# Altium schematic sheet 下程序炸炉.SchDoc
size A1
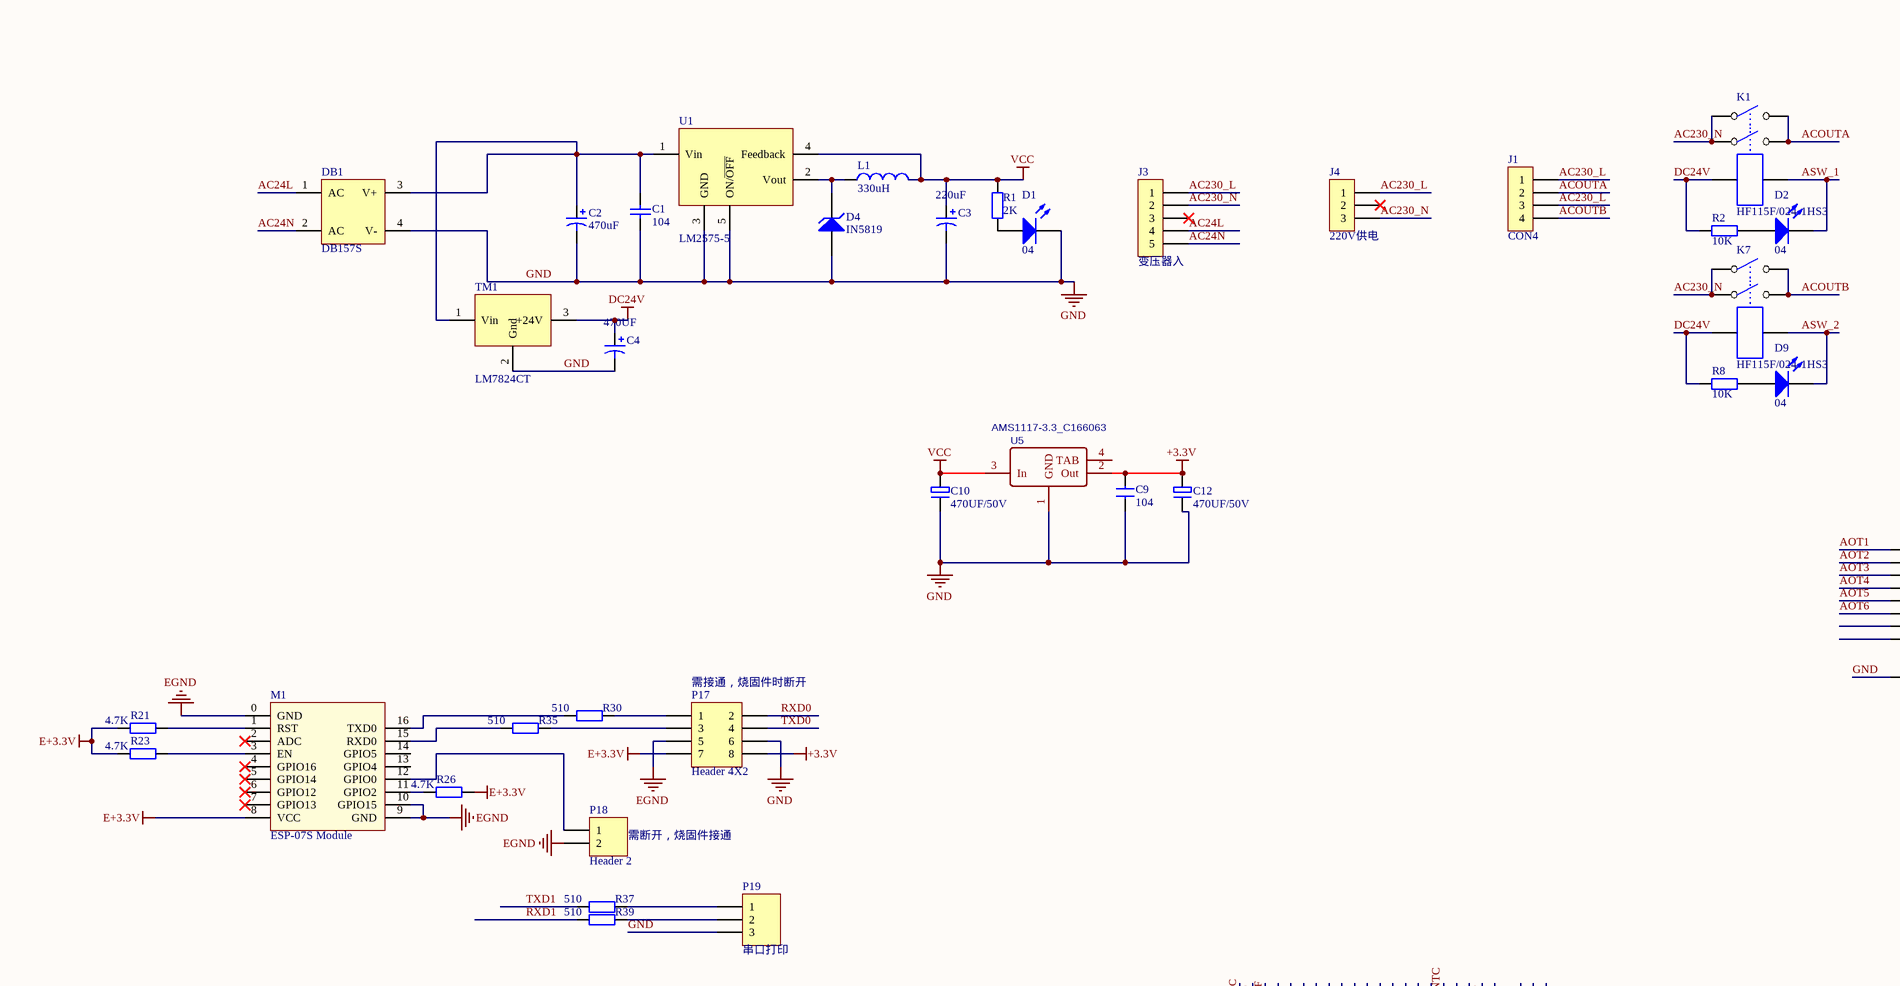
[diagram p0: 下程序炸炉.SchDoc, top left]
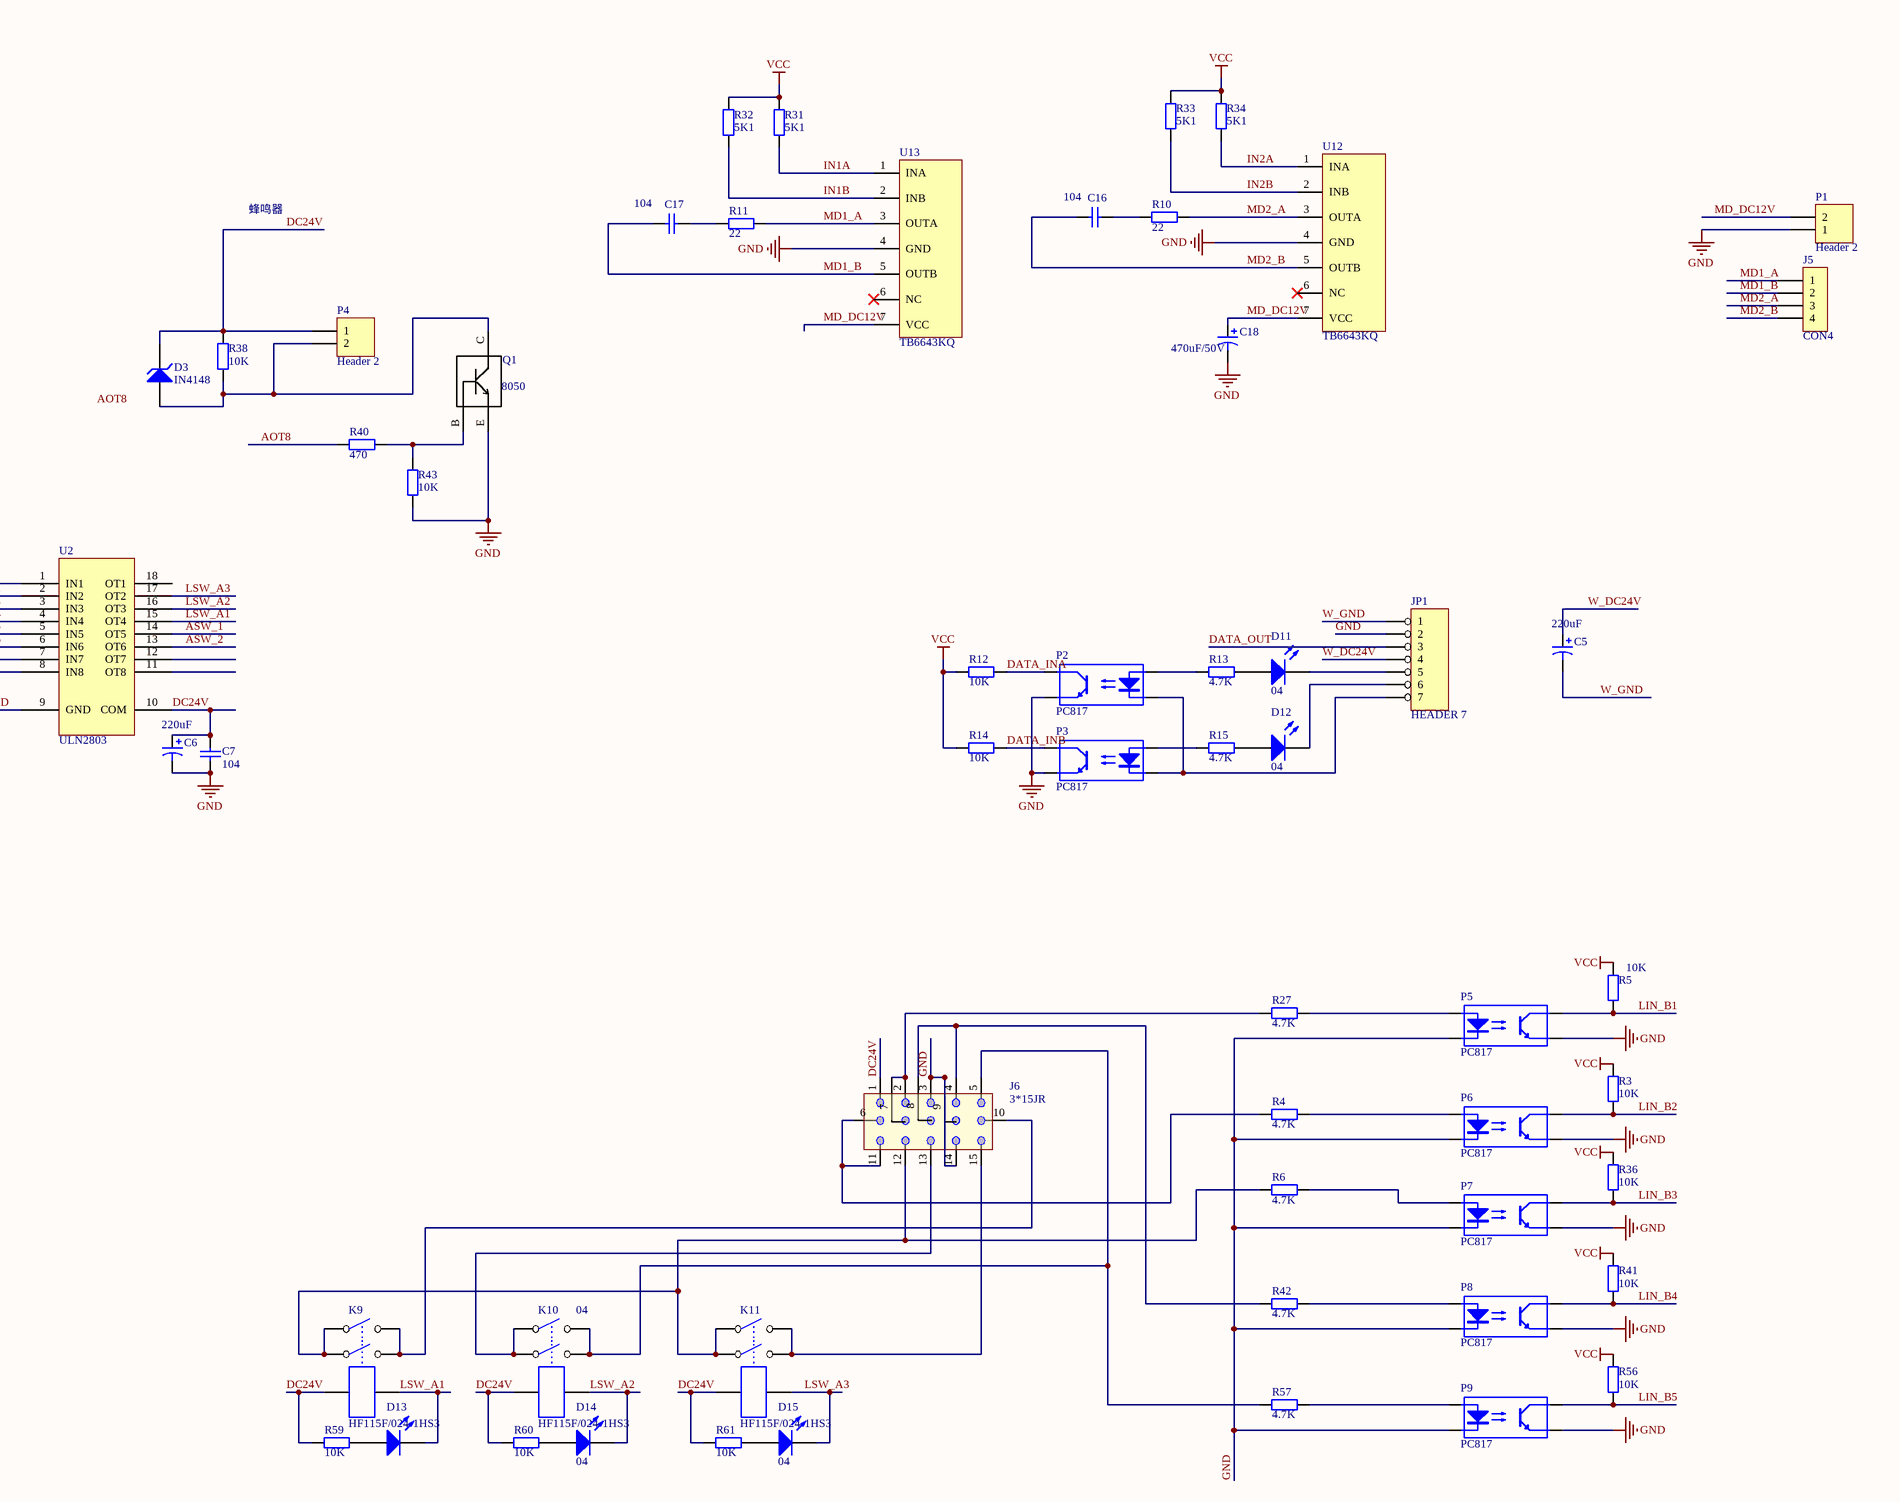
[diagram p1: 下程序炸炉.SchDoc, top right]
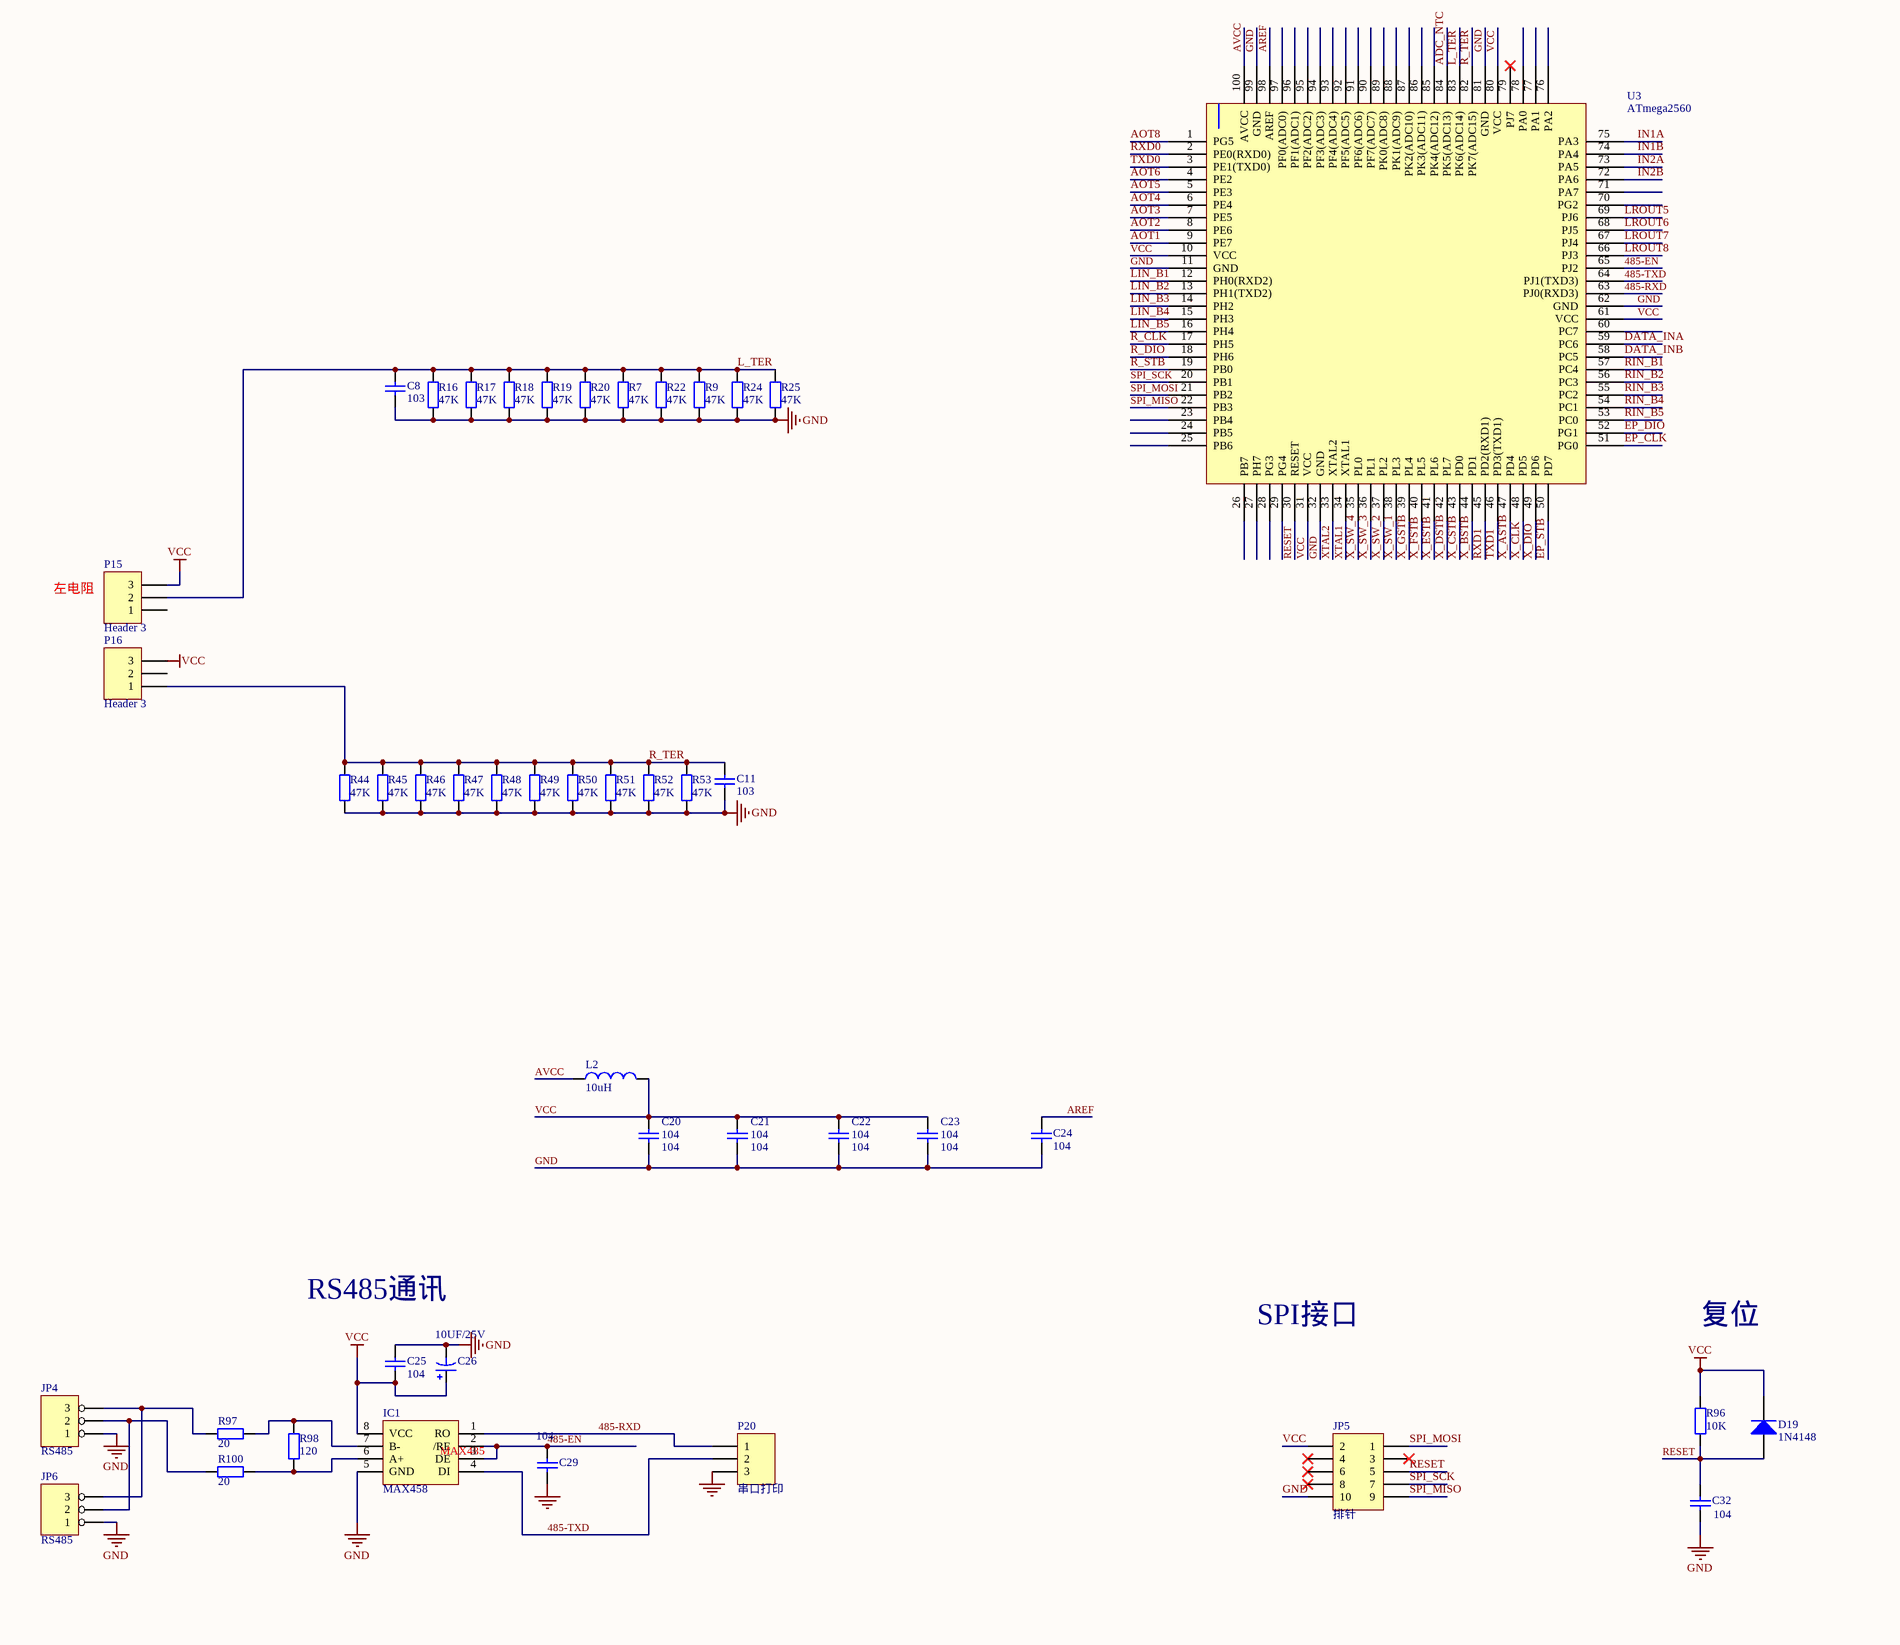
[diagram p2: 下程序炸炉.SchDoc, bottom left]
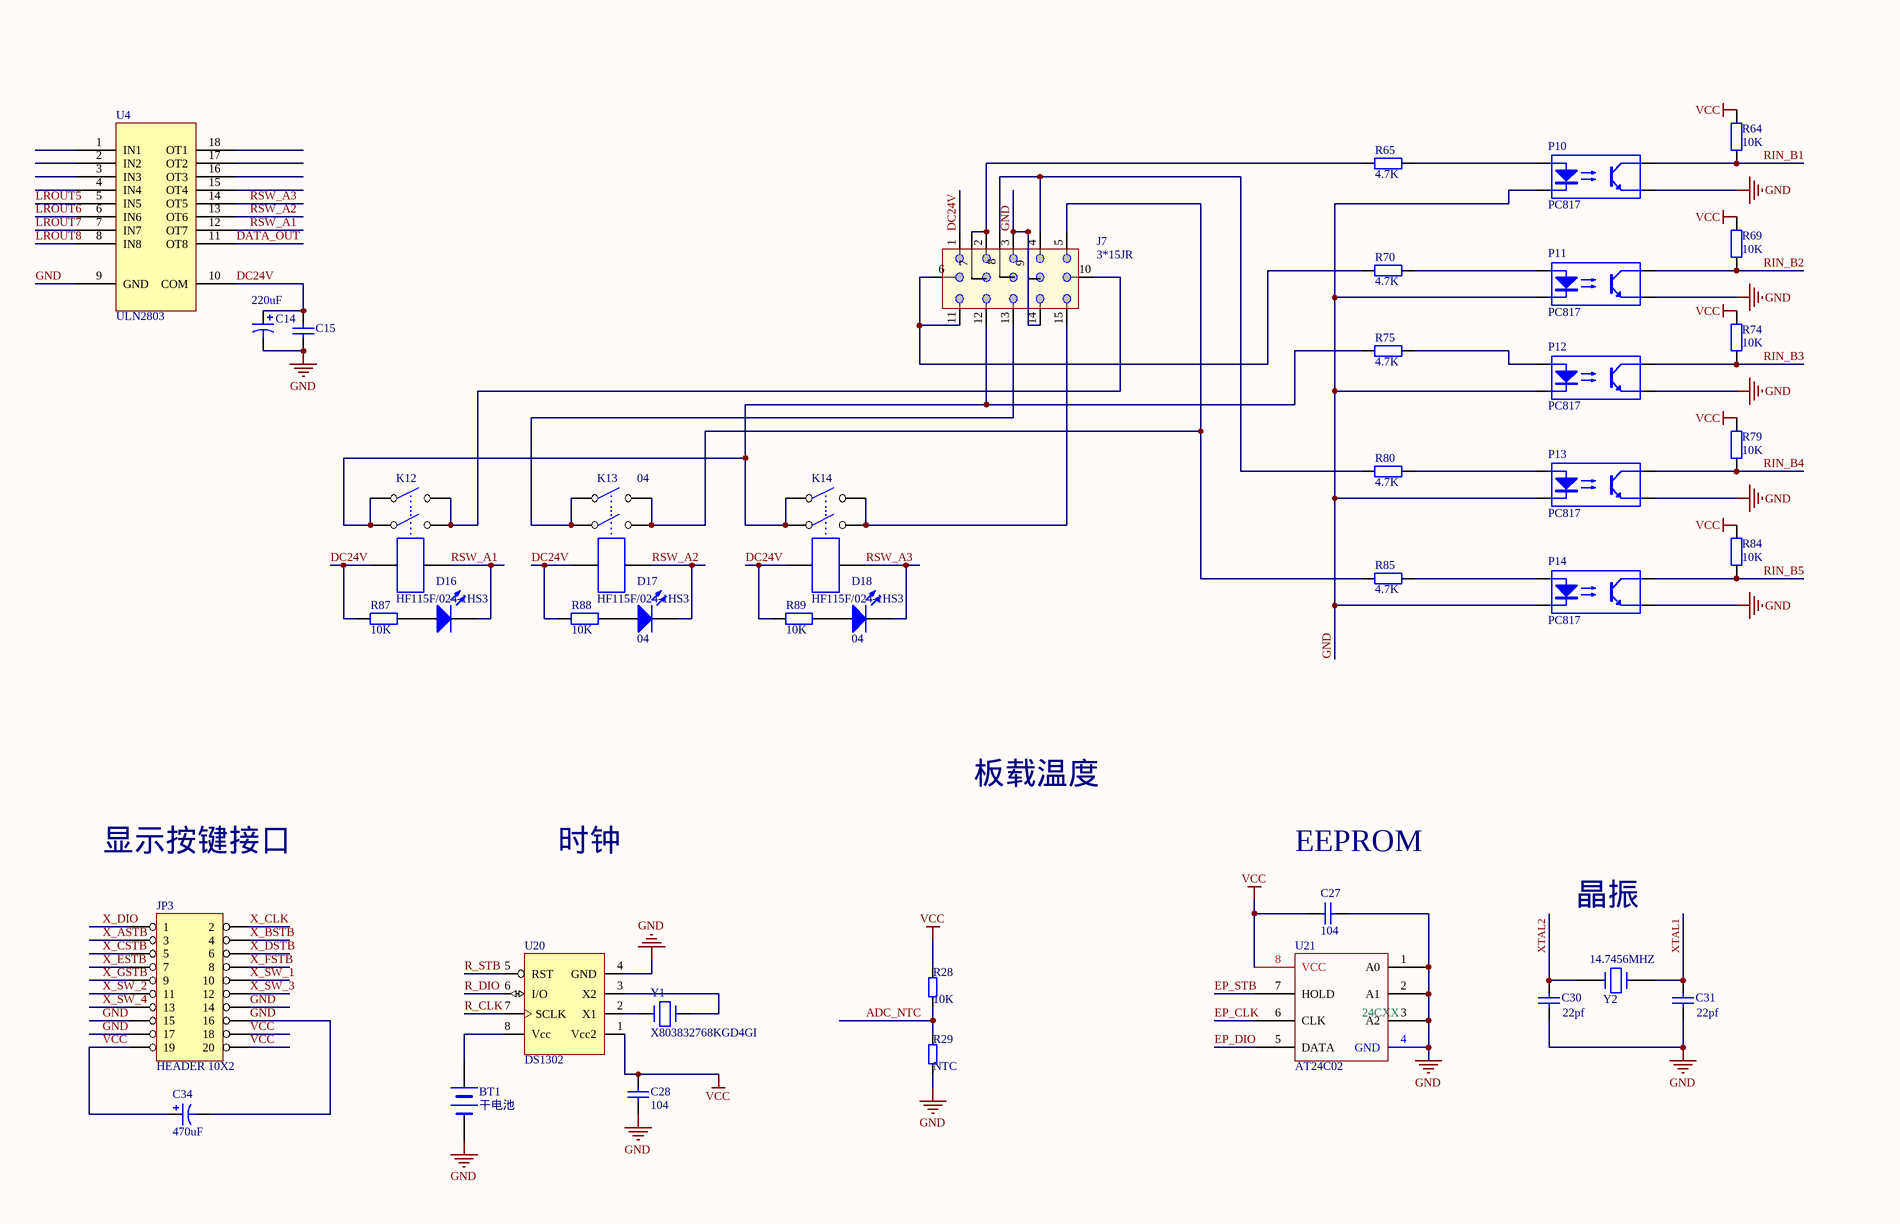
[diagram p3: 下程序炸炉.SchDoc, bottom right]

## Parts
BT1  干电池  [BAT-TH_BS-2-1]
C1  104  [0805]
C2  value 470uF  [CD9]  (hidden comment: 470UF/50V)
C3  220uF  [CD9]
C4  470UF  [CD9]
C5  220uF  [CD9]
C6  220uF  [CD9]
C7  104  [0805]
C8  103  [0805]
C9  104  [0805]
C10  470UF/50V  [CD9]
C11  103  [0805]
C12  470UF/50V  [CD9]
C14  220uF  [CD9]
C15  104  [0805]  (value not drawn)
C16  104  [0805]
C17  104  [0805]
C18  470uF/50V  [CD9]
C20  104  [0805]
C21  104  [0805]
C22  104  [0805]
C23  104  [0805]
C24  104  [0805]
C25  104  [0805]
C26  10UF/25V  [cap]
C27  104  [0805]
C28  104  [0805]
C29  104  [0805]
C30  22pf  [0805]
C31  22pf  [0805]
C32  104  [0805]
C34  value 470uF  [CD9]  (hidden comment: 470UF/50V)
D1  04  [LED-T]
D2  04  [LED-T]
D3  IN4148  [DO-214AC]
D4  IN5819  [DO-214AC]
D9  04  [LED-T]
D11  04  [LED-T]
D12  04  [LED-T]
D13  04  [LED-T]
D14  04  [LED-T]
D15  04  [LED-T]
D16  04  [LED-T]
D17  04  [LED-T]
D18  04  [LED-T]
D19  1N4148  [DO-214AC]
DB1  DB157S  [LC-GBU]
IC1  MAX458  [SOIC-8_150mil]
J1  CON4  [4PIN-6.3]
J3  变压器入  [5PIN-6.3]
J4  220V供电  [3PIN-6.3]
J5  CON4  [4PIN 3.96]
J6  3*15JR  [3*5PIN-6.3]
J7  3*15JR  [3*5PIN-6.3]
JP1  HEADER 7  [7PIN 3.96]
JP3  HEADER 10X2  [HDR2X10]
JP4  RS485  [3PIN 3.96]
JP5  排针  [HDR2X5 - duplicate - duplicate]
JP6  RS485  [3PIN 3.96]
K1  HF115F/024-1HS3  [HF115FA]
K7  HF115F/024-1HS3  [HF115FA]
K9  HF115F/024-1HS3  [HF115FA]
K10  HF115F/024-1HS3  [HF115FA]
K11  HF115F/024-1HS3  [HF115FA]
K12  HF115F/024-1HS3  [HF115FA]
K13  HF115F/024-1HS3  [HF115FA]
K14  HF115F/024-1HS3  [HF115FA]
L1  330uH  [SMD331]
L2  10uH  [1206]
M1  ESP-07S Module  [ESP-07S Module]
P1  Header 2  [2PIN 3.96]
P2  PC817  [LC-SMD-4]
P3  PC817  [LC-SMD-4]
P4  Header 2  [2PIN 3.96]
P5  PC817  [LC-SMD-4]
P6  PC817  [LC-SMD-4]
P7  PC817  [LC-SMD-4]
P8  PC817  [LC-SMD-4]
P9  PC817  [LC-SMD-4]
P10  PC817  [LC-SMD-4]
P11  PC817  [LC-SMD-4]
P12  PC817  [LC-SMD-4]
P13  PC817  [LC-SMD-4]
P14  PC817  [LC-SMD-4]
P15  Header 3  [3PIN 3.96]
P16  Header 3  [3PIN 3.96]
P17  Header 4X2  [HDR2X4]
P18  Header 2  [HDR1X2]
P19  串口打印  [HDR1X3]
P20  串口打印  [HDR1X3]
Q1  8050  [SOT-23 - duplicate]
R1  2K  [0805]
R2  10k  [0805]
R3  10k  [0805]
R4  4.7K  [0805]
R5  10k  [0805]
R6  4.7K  [0805]
R7  47K  [0805]
R8  10k  [0805]
R9  47K  [0805]
R10  22  [1206]
R11  22  [1206]
R12  10k  [0805]
R13  4.7K  [0805]
R14  10k  [0805]
R15  4.7K  [0805]
R16  47K  [0805]
R17  47K  [0805]
R18  47K  [0805]
R19  47K  [0805]
R20  47K  [0805]
R21  4.7K  [0805]
R22  47K  [0805]
R23  4.7K  [0805]
R24  47K  [0805]
R25  47K  [0805]
R26  4.7K  [0805]
R27  4.7K  [0805]
R28  10K  [0805]
R29  NTC  [0805]
R30  510  [0805]
R31  5K1  [0805]
R32  5K1  [0805]
R33  5K1  [0805]
R34  5K1  [0805]
R35  510  [0805]
R36  10k  [0805]
R37  510  [0805]
R38  10K  [0805]
R39  510  [0805]
R40  470  [0805]
R41  10k  [0805]
R42  4.7K  [0805]
R43  10K  [0805]
R44  47K  [0805]
R45  47K  [0805]
R46  47K  [0805]
R47  47K  [0805]
R48  47K  [0805]
R49  47K  [0805]
R50  47K  [0805]
R51  47K  [0805]
R52  47K  [0805]
R53  47K  [0805]
R56  10k  [0805]
R57  4.7K  [0805]
R59  10k  [0805]
R60  10k  [0805]
R61  10k  [0805]
R64  10k  [0805]
R65  4.7K  [0805]
R69  10k  [0805]
R70  4.7K  [0805]
R74  10k  [0805]
R75  4.7K  [0805]
R79  10k  [0805]
R80  4.7K  [0805]
R84  10k  [0805]
R85  4.7K  [0805]
R87  10k  [0805]
R88  10k  [0805]
R89  10k  [0805]
R96  10k  [0805]
R97  20  [0805]
R98  120  [0805]
R100  20  [0805]
TM1  LM7824CT  [TO-220]
U1  LM2575-5  [D2PAK]
U2  ULN2803  [SOP-18_300mil]
U3  ATmega2560  [TQFP100]
U4  ULN2803  [SOP-18_300mil]
U5  AMS1117-3.3_C166063  [SOT-223_L6.7-W3.5-P2.30-BR]
U12  TB6643KQ  [TA8428 - S]
U13  TB6643KQ  [TA8428 - S]
U20  DS1302  [SOIC-8_150mil]
U21  AT24C02  [SOIC-8_150mil]
Y1  X803832768KGD4GI  [YSX306]
Y2  14.7456MHZ  [HC-49SMD]

## Nets
+3.3V: C9.1 C12.1 P17.8 U5.2(Out)
DC24V: C4.1 C6.1 C7.2 C14.1 C15.2 D3.2(K) J6.1 J7.1 K1.5 K7.5 K9.5 K10.5 K11.5 K12.5 K13.5 K14.5 P4.1 R2.2 R8.2 R38.2 R59.2 R60.2 R61.2 R87.2 R88.2 R89.2 TM1.3(+24V) U2.10(COM) U4.10(COM)
E+3.3V: M1.8(VCC) P17.7 R21.2 R23.2 R26.1
EGND: M1.0(GND) M1.9(GND) M1.10(GPIO15) P17.5 P18.2
GND: BT1.2(-) C1.1 C2.2 C3.2 C4.2 C6.2 C7.1 C8.1 C9.2 C10.2 C11.1 C12.2 C14.2 C15.1 C18.2 C20.1 C21.1 C22.1 C23.1 C24.1 C25.2 C26.2 C27.1 C28.1 C29.1 C30.1 C31.1 C32.1 C34.2 D1.2(K) D4.1(A) DB1.4(V-) IC1.5(GND) J6.3 J6.9 J6.14 J7.3 J7.9 J7.14 JP1.2 JP3.14 JP3.15 JP3.16 JP3.17 JP4.1 JP5.10 JP6.1 P1.1 P2.3(Emitter) P3.3(Emitter) P5.2(LED_Cathode) P5.3(Emitter) P6.2(LED_Cathode) P6.3(Emitter) P7.2(LED_Cathode) P7.3(Emitter) P8.2(LED_Cathode) P8.3(Emitter) P9.2(LED_Cathode) P9.3(Emitter) P10.2(LED_Cathode) P10.3(Emitter) P11.2(LED_Cathode) P11.3(Emitter) P12.2(LED_Cathode) P12.3(Emitter) P13.2(LED_Cathode) P13.3(Emitter) P14.2(LED_Cathode) P14.3(Emitter) P17.6 P19.3 P20.3 Q1.E R7.1 R9.1 R16.1 R17.1 R18.1 R19.1 R20.1 R22.1 R24.1 R25.1 R29.1 R43.1 R44.1 R45.1 R46.1 R47.1 R48.1 R49.1 R50.1 R51.1 R52.1 R53.1 TM1.2(Gnd) U1.3(GND) U1.5(ON/~{OFF}) U2.9(GND) U3.11(GND) U3.32(GND) U3.62(GND) U3.81(GND) U3.99(GND) U4.9(GND) U5.1(GND) U12.4(GND) U13.4(GND) U20.4(GND) U21.1(A0) U21.2(A1) U21.3(A2) U21.4(GND)
VCC: C3.1 C10.1 C20.2 C21.2 C22.2 C23.2 C25.1 C26.1 C27.2 C28.2 C34.1 D19.2(K) IC1.8(VCC) JP3.18 JP3.19 JP3.20 JP5.2 L1.2 L2.2 P15.3 P16.3 R1.2 R3.2 R5.2 R12.1 R14.1 R28.2 R31.2 R32.2 R33.2 R34.2 R36.2 R41.2 R56.2 R64.2 R69.2 R74.2 R79.2 R84.2 R96.2 U1.4(Feedback) U3.10(VCC) U3.31(VCC) U3.61(VCC) U3.80(VCC) U5.3(In) U20.1(Vcc2) U21.8(VCC)
485-EN: C29.2 IC1.2(/RE) IC1.3(DE) U3.65(PJ2)
485-RXD: IC1.1(RO) P20.1 U3.63(PJ0(RXD3))
485-TXD: IC1.4(DI) P20.2 U3.64(PJ1(TXD3))
AC24L: DB1.1(AC) J3.4
AC24N: DB1.2(AC) J3.5
AC230_L: J1.1 J1.3 J3.1 J4.1
AC230_N: J3.2 J4.3 K1.1 K1.3 K7.1 K7.3
ACOUTA: J1.2 K1.2 K1.4
ACOUTB: J1.4 K7.2 K7.4
ADC_NTC: R28.1 R29.2 U3.84(PK5(ADC13))
AOT1: U2.1(IN1) U3.9(PE7)
AOT2: U2.2(IN2) U3.8(PE6)
AOT3: U2.3(IN3) U3.7(PE5)
AOT4: U2.4(IN4) U3.6(PE4)
AOT5: U2.5(IN5) U3.5(PE3)
AOT6: U2.6(IN6) U3.4(PE2)
AOT8: R40.1 U3.1(PG5)
AREF: C24.2 U3.98(AREF)
ASW_1: D2.2(K) K1.6 U2.14(OT5)
ASW_2: D9.2(K) K7.6 U2.13(OT6)
AVCC: L2.1 U3.100(AVCC)
DATA_INA: P2.4(Collector) R12.2 U3.59(PC6)
DATA_INB: P3.4(Collector) R14.2 U3.58(PC5)
DATA_OUT: JP1.3 U4.11(OT8)
EP_CLK: U3.51(PG0) U21.6(CLK)
EP_DIO: U3.52(PG1) U21.5(DATA)
EP_STB: U3.50(PD7) U21.7(HOLD)
IN1A: R31.1 U3.75(PA3) U13.1(INA)
IN1B: R32.1 U3.74(PA4) U13.2(INB)
IN2A: R34.1 U3.73(PA5) U12.1(INA)
IN2B: R33.1 U3.72(PA6) U12.2(INB)
L_TER: C8.2 P15.2 R7.2 R9.2 R16.2 R17.2 R18.2 R19.2 R20.2 R22.2 R24.2 R25.2 U3.83(PK6(ADC14))
LIN_B1: P5.4(Collector) R5.1 U3.12(PH0(RXD2))
LIN_B2: P6.4(Collector) R3.1 U3.13(PH1(TXD2))
LIN_B3: P7.4(Collector) R36.1 U3.14(PH2)
LIN_B4: P8.4(Collector) R41.1 U3.15(PH3)
LIN_B5: P9.4(Collector) R56.1 U3.16(PH4)
LROUT5: U3.69(PJ6) U4.5(IN5)
LROUT6: U3.68(PJ5) U4.6(IN6)
LROUT7: U3.67(PJ4) U4.7(IN7)
LROUT8: U3.66(PJ3) U4.8(IN8)
LSW_A1: D13.2(K) K9.6 U2.15(OT4)
LSW_A2: D14.2(K) K10.6 U2.16(OT3)
LSW_A3: D15.2(K) K11.6 U2.17(OT2)
MD1_A: J5.1 R11.1 U13.3(OUTA)
MD1_B: C17.2 J5.2 U13.5(OUTB)
MD2_A: J5.3 R10.1 U12.3(OUTA)
MD2_B: C16.2 J5.4 U12.5(OUTB)
MD_DC12V: C18.1 P1.2 U12.7(VCC) U13.7(VCC)
R_CLK: U3.17(PH5) U20.7(SCLK)
R_DIO: U3.18(PH6) U20.6(I/O)
R_STB: U3.19(PB0) U20.5(RST)
R_TER: C11.2 P16.1 R44.2 R45.2 R46.2 R47.2 R48.2 R49.2 R50.2 R51.2 R52.2 R53.2 U3.82(PK7(ADC15))
RESET: C32.2 D19.1(A) JP5.5 R96.1 U3.30(RESET)
RIN_B1: P10.4(Collector) R64.1 U3.57(PC4)
RIN_B2: P11.4(Collector) R69.1 U3.56(PC3)
RIN_B3: P12.4(Collector) R74.1 U3.55(PC2)
RIN_B4: P13.4(Collector) R79.1 U3.54(PC1)
RIN_B5: P14.4(Collector) R84.1 U3.53(PC0)
RSW_A1: D16.2(K) K12.6 U4.12(OT7)
RSW_A2: D17.2(K) K13.6 U4.13(OT6)
RSW_A3: D18.2(K) K14.6 U4.14(OT5)
RXD0: P17.2 U3.2(PE0(RXD0))
RXD1: R39.2 U3.45(PD2(RXD1))
SPI_MISO: JP5.9 U3.22(PB3)
SPI_MOSI: JP5.1 U3.21(PB2)
SPI_SCK: JP5.7 U3.20(PB1)
TXD0: P17.4 U3.3(PE1(TXD0))
TXD1: R37.2 U3.46(PD3(TXD1))
W_DC24V: C5.1 JP1.4
W_GND: C5.2 JP1.1
X_ASTB: JP3.3 U3.47(PD4)
X_BSTB: JP3.4 U3.44(PD1)
X_CLK: JP3.2 U3.48(PD5)
X_CSTB: JP3.5 U3.43(PD0)
X_DIO: JP3.1 U3.49(PD6)
X_DSTB: JP3.6 U3.42(PL7)
X_ESTB: JP3.7 U3.41(PL6)
X_FSTB: JP3.8 U3.40(PL5)
X_GSTB: JP3.9 U3.39(PL4)
X_SW_1: JP3.10 U3.38(PL3)
X_SW_2: JP3.11 U3.37(PL2)
X_SW_3: JP3.12 U3.36(PL1)
X_SW_4: JP3.13 U3.35(PL0)
XTAL1: C31.2 U3.34(XTAL1) Y2.2
XTAL2: C30.2 U3.33(XTAL2) Y2.1
NetBT1_1: BT1.1(+) U20.8(Vcc)
NetC1_2: C1.2 C2.1 DB1.3(V+) TM1.1(Vin) U1.1(Vin)
NetC16_1: C16.1 R10.2
NetC17_1: C17.1 R11.2
NetD1_1: D1.1(A) R1.1
NetD2_1: D2.1(A) R2.1
NetD3_1: D3.1(A) P4.2 Q1.C R38.1
NetD4_2: D4.2(K) L1.1 U1.2(Vout)
NetD9_1: D9.1(A) R8.1
NetD11_1: D11.1(A) R13.1
NetD11_2: D11.2(K) JP1.5
NetD12_1: D12.1(A) R15.1
NetD12_2: D12.2(K) JP1.6
NetD13_1: D13.1(A) R59.1
NetD14_1: D14.1(A) R60.1
NetD15_1: D15.1(A) R61.1
NetD16_1: D16.1(A) R87.1
NetD17_1: D17.1(A) R88.1
NetD18_1: D18.1(A) R89.1
NetIC1_6: IC1.6(A+) R98.2 R100.1
NetIC1_7: IC1.7(B-) R97.1 R98.1
NetJ6_2: J6.2 J6.7 R27.1
NetJ6_4: J6.4 J6.8 R42.1
NetJ6_5: J6.5 K10.2 K10.4 R57.1
NetJ6_6: J6.6 J6.11 R4.1
NetJ6_10: J6.10 K9.2 K9.4
NetJ6_12: J6.12 K9.1 K9.3 K11.1 K11.3 R6.1
NetJ6_13: J6.13 K10.1 K10.3
NetJ6_15: J6.15 K11.2 K11.4
NetJ7_2: J7.2 J7.7 R65.1
NetJ7_4: J7.4 J7.8 R80.1
NetJ7_5: J7.5 K13.2 K13.4 R85.1
NetJ7_6: J7.6 J7.11 R70.1
NetJ7_10: J7.10 K12.2 K12.4
NetJ7_12: J7.12 K12.1 K12.3 K14.1 K14.3 R75.1
NetJ7_13: J7.13 K13.1 K13.3
NetJ7_15: J7.15 K14.2 K14.4
NetJP1_7: JP1.7 P2.2(LED_Cathode) P3.2(LED_Cathode)
NetJP4_2: JP4.2 JP6.2 R100.2
NetJP4_3: JP4.3 JP6.3 R97.2
NetM1_1: M1.1(RST) R21.1
NetM1_3: M1.3(EN) R23.1
NetM1_11: M1.11(GPIO2) R26.2
NetM1_12: M1.12(GPIO0) P18.1
NetM1_15: M1.15(RXD0) R35.2
NetM1_16: M1.16(TXD0) R30.2
NetP2_1: P2.1(LED_Anode) R13.2
NetP3_1: P3.1(LED_Anode) R15.2
NetP5_1: P5.1(LED_Anode) R27.2
NetP6_1: P6.1(LED_Anode) R4.2
NetP7_1: P7.1(LED_Anode) R6.2
NetP8_1: P8.1(LED_Anode) R42.2
NetP9_1: P9.1(LED_Anode) R57.2
NetP10_1: P10.1(LED_Anode) R65.2
NetP11_1: P11.1(LED_Anode) R70.2
NetP12_1: P12.1(LED_Anode) R75.2
NetP13_1: P13.1(LED_Anode) R80.2
NetP14_1: P14.1(LED_Anode) R85.2
NetP17_1: P17.1 R30.1
NetP17_3: P17.3 R35.1
NetP19_1: P19.1 R37.1
NetP19_2: P19.2 R39.1
NetQ1_B: Q1.B R40.2 R43.2
NetU20_2: U20.2(X1) Y1.1
NetU20_3: U20.3(X2) Y1.2

Not connected (* = marked no-connect by the designer): J3 3*; J4 2*; JP5 3* 4* 6* 8*; M1 2(ADC)* 4(GPIO16)* 5(GPIO14)* 6(GPIO12)* 7(GPIO13)* 13(GPIO4) 14(GPIO5); P15 1; P16 2; U2 7(IN7) 8(IN8) 11(OT8) 12(OT7) 18(OT1); U3 23(PB4) 24(PB5) 25(PB6) 26(PB7) 27(PH7) 28(PG3) 29(PG4) 60(PC7) 70(PG2) 71(PA7) 76(PA2) 77(PA1) 78(PA0) 79(PJ7)* 85(PK4(ADC12)) 86(PK3(ADC11)) 87(PK2(ADC10)) 88(PK1(ADC9)) 89(PK0(ADC8)) 90(PF7(ADC7)) 91(PF6(ADC6)) 92(PF5(ADC5)) 93(PF4(ADC4)) 94(PF3(ADC3)) 95(PF2(ADC2)) 96(PF1(ADC1)) 97(PF0(ADC0)); U4 1(IN1) 2(IN2) 3(IN3) 4(IN4) 15(OT4) 16(OT3) 17(OT2) 18(OT1); U5 4(TAB); U12 6(NC)*; U13 6(NC)*

## Notes on the sheet
- 蜂鸣器
- (near P17) 需接通，烧固件时断开
- (near P18) 需断开，烧固件接通
- 左电阻
- 板载温度
- RS485通讯
- SPI接口
- 复位
- 显示按键接口
- 时钟
- EEPROM
- 晶振
- Labels drawn without touching a wire or pin: AOT8
- Title
- Size:
- Date:
- File:
- A1
- Number:
- Time:
- Revision:
- Sheet
- of

## Library data of the parts
BT1 = 干电池: Battery
C1 C7 C8 C11 C15-C17 C20-C25 C27-C32 = Cap: Capacitor; Published: 8-Jun-2000; LatestRevisionDate: 17-Jul-2002; LatestRevisionNote: Re-released for DXP Platform.; PackageReference: RAD-0.3; Publisher: Altium Limited
  C1 C7 C15 C20-C25 C27-C29: Value: 104
  C8 C11: Value: 103
C2 C4 C18 C34 = Cap Pol1: Polarized Capacitor (Radial); Published: 8-Jun-2000; LatestRevisionDate: 17-Jul-2002; LatestRevisionNote: Re-released for DXP Platform.; PackageReference: RB7.6-15; Publisher: Altium Limited
  C4: Value: 470uF
C3 C5 C6 C14 = Cap Pol1: Polarized Capacitor (Radial); Value: 470uF; Published: 8-Jun-2000; LatestRevisionDate: 17-Jul-2002; LatestRevisionNote: Re-released for DXP Platform.; PackageReference: RB7.6-15; Publisher: Altium Limited
C9 = CAP
C10 C12 = ECAP
C26 = Cap Pol1: Polarized Capacitor (Radial); Value: 10uF/10V; Published: 8-Jun-2000; LatestRevisionDate: 17-Jul-2002; LatestRevisionNote: Re-released for DXP Platform.; PackageReference: RB7.6-15; Publisher: Altium Limited
D1 D2 D9 D11-D18 = LED0: Typical INFRARED GaAs LED; Published: 8-Jun-2000; LatestRevisionDate: 08-Jul-2005; LatestRevisionNote: Mech Layer 1 removed.; PackageReference: LED-0; Publisher: Altium Limited; PackageDescription: LED; 2 Leads
D3 D4 = D Zener: Zener Diode; Published: 8-Jun-2000; LatestRevisionDate: 17-Jul-2002; LatestRevisionNote: Re-released for DXP Platform.; PackageReference: DIODE-0.7; Publisher: Altium Limited
D19 = Diode 1N4148: High Conductance Fast Diode; Published: 8-Jun-2000; LatestRevisionDate: 17-Jul-2002; LatestRevisionNote: Re-released for DXP Platform.; DatasheetVersion: 1997; PackageReference: DO-35; Publisher: Altium Limited; PackageDescription: Diode, Axial; Body 3.8 x 1.9 mm (LxDia. max), Lead Dia. 0.53 mm (max); Code_JEDEC: DO-204-AH; ComponentLink1Description: Manufacturer Link; ComponentLink1URL: http://www.fairchildsemi.com/; ComponentLink2Description: Datasheet; ComponentLink2URL: http://www.fairchildsemi.com/ds/1N%2F1N4148.pdf
DB1 = BRIDGE2
IC1 = MAX485
J1 J5 = CON4: Connector
J3 = CON5: Connector
J4 = CON3: Connector
J6 J7 U12 U13 = Component_1
JP4 JP6 = HEADER 3
JP5 = Header 5X2: Header, 5-Pin, Dual row; LatestRevisionDate: 17-Jul-2002; LatestRevisionNote: Re-released for DXP Platform.; Publisher: Altium Limited
K1 K7 K9-K14 = RELAY-DPST
L1 L2 = Inductor: Code_IEC: 1005; Published: 8-Jun-2000; LatestRevisionDate: 29-May-2009; LatestRevisionNote: IPC-7351 Footprint Added.; PackageReference: 0402-A; Publisher: Altium Limited; PackageDescription: Chip Inductor; Code_JEITA: 0402
  L2: Value: 10uH
P1 P4 P18 = Header 2: Header, 2-Pin; LatestRevisionDate: 17-Jul-2002; LatestRevisionNote: Re-released for DXP Platform.; Publisher: Altium Limited
P2 P3 P5-P14 = P521
P15 P16 P19 P20 = Header 3: Header, 3-Pin; LatestRevisionDate: 17-Jul-2002; LatestRevisionNote: Re-released for DXP Platform.; Publisher: Altium Limited
P17 = Header 4X2: Header, 4-Pin, Dual row; LatestRevisionDate: 17-Jul-2002; LatestRevisionNote: Re-released for DXP Platform.; Publisher: Altium Limited
Q1 = BC817-8050
R1-R27 R30-R37 R39 R41 R42 R44-R53 R56 R57 R59-R61 R64 R65 R69 R70 R74 R75 R79 R80 R84 R85 R87-R89 R96-R98 R100 = Res2: Resistor; Published: 8-Jun-2000; LatestRevisionDate: 17-Jul-2002; LatestRevisionNote: Re-released for DXP Platform.; PackageReference: AXIAL-0.4; Publisher: Altium Limited
  R1: Value: 2K
  R2 R3 R5 R8 R12 R14 R36 R41 R56 R59-R61 R64 R69 R74 R79 R84 R87-R89 R96: Value: 10K
  R4 R6 R13 R15 R27 R42 R57 R65 R70 R75 R80 R85: Value: 4.7K
  R7 R9 R16-R20 R22 R24 R25 R44-R53: Value: 47K
  R31-R34: Value: 5K1
  R97 R100: Value: 20
  R98: Value: 120
R28 R29 = RES
R38 R40 R43 = Res2: Resistor; Value: RT0603BRD071KL YAGEO; Published: 8-Jun-2000; LatestRevisionDate: 17-Jul-2002; LatestRevisionNote: Re-released for DXP Platform.; PackageReference: AXIAL-0.4; Publisher: Altium Limited
U1 = LM2575
U3 = ATmega1280
U5 = AMS1117-1.5_C166063: BOM_Manufacturer: SK; Contributor: LCSC; SMT Type: Extend; BOM_Supplier: LCSC; BOM_Supplier Part: C166063; BOM_Manufacturer Part: AMS1117-1.5; BOM_LCSC Assembly: Yes; spicePre: U
U21 = 24CXX
Y1 Y2 = CRYSTAL